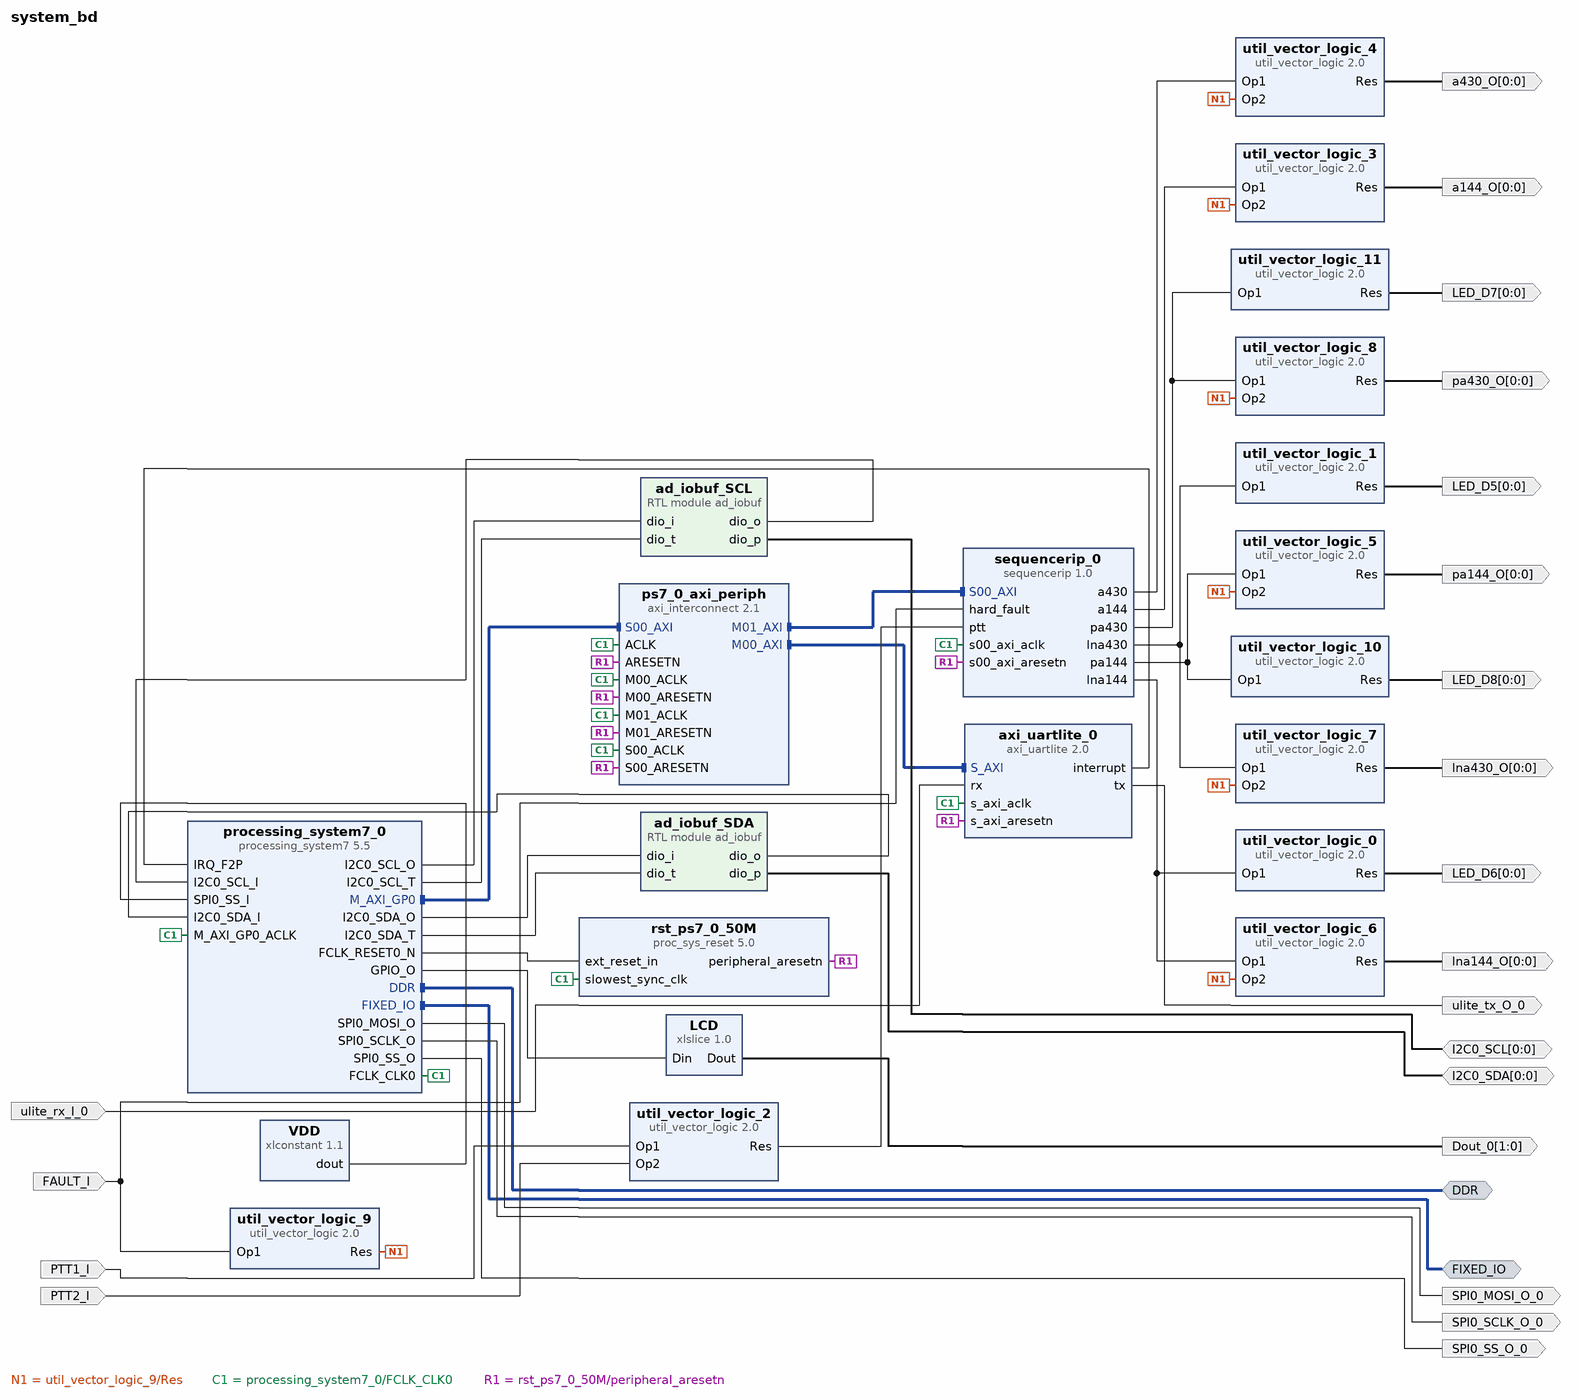
[diagram p0: block diagram of the top level]
# Vivado block design system_bd, xc7z010clg400-1, Vivado 2022.2.2
create_bd_design system_bd

create_bd_intf_port -mode Master -vlnv xilinx.com:interface:ddrx_rtl:1.0 DDR
create_bd_intf_port -mode Master -vlnv xilinx.com:display_processing_system7:fixedio_rtl:1.0 FIXED_IO
create_bd_port -dir O SPI0_SS_O_0
create_bd_port -dir O SPI0_MOSI_O_0
create_bd_port -dir O SPI0_SCLK_O_0
create_bd_port -dir O -from 1 -to 0 Dout_0
create_bd_port -dir I ulite_rx_I_0
create_bd_port -dir O ulite_tx_O_0
create_bd_port -dir O -from 0 -to 0 LED_D5
create_bd_port -dir O -from 0 -to 0 LED_D6
create_bd_port -dir O -from 0 -to 0 LED_D7
create_bd_port -dir O -from 0 -to 0 LED_D8
create_bd_port -dir O -from 0 -to 0 lna144_O
create_bd_port -dir O -from 0 -to 0 pa144_O
create_bd_port -dir O -from 0 -to 0 a144_O
create_bd_port -dir O -from 0 -to 0 lna430_O
create_bd_port -dir O -from 0 -to 0 pa430_O
create_bd_port -dir O -from 0 -to 0 a430_O
create_bd_port -dir I PTT1_I
create_bd_port -dir I PTT2_I
create_bd_port -dir I FAULT_I
create_bd_port -dir IO -from 0 -to 0 I2C0_SDA
create_bd_port -dir IO -from 0 -to 0 I2C0_SCL

create_bd_cell -type ip -vlnv xilinx.com:ip:processing_system7:5.5 processing_system7_0
set_property -dict [list \
  CONFIG.PCW_ENET0_ENET0_IO {MIO 16 .. 27} \
  CONFIG.PCW_ENET0_GRP_MDIO_ENABLE 1 \
  CONFIG.PCW_ENET0_GRP_MDIO_IO {MIO 52 .. 53} \
  CONFIG.PCW_ENET0_PERIPHERAL_ENABLE 1 \
  CONFIG.PCW_ENET0_PERIPHERAL_FREQMHZ {100 Mbps} \
  CONFIG.PCW_ENET_RESET_ENABLE 0 \
  CONFIG.PCW_GPIO_EMIO_GPIO_ENABLE 1 \
  CONFIG.PCW_GPIO_EMIO_GPIO_IO 64 \
  CONFIG.PCW_GPIO_MIO_GPIO_ENABLE 1 \
  CONFIG.PCW_GPIO_MIO_GPIO_IO MIO \
  CONFIG.PCW_I2C0_I2C0_IO EMIO \
  CONFIG.PCW_I2C0_PERIPHERAL_ENABLE 1 \
  CONFIG.PCW_I2C_PERIPHERAL_FREQMHZ 111.111115 \
  CONFIG.PCW_I2C_RESET_ENABLE 0 \
  CONFIG.PCW_IRQ_F2P_INTR 1 \
  CONFIG.PCW_NAND_NAND_IO {MIO 0 2.. 14} \
  CONFIG.PCW_NAND_PERIPHERAL_ENABLE 1 \
  CONFIG.PCW_PRESET_BANK1_VOLTAGE {LVCMOS 2.5V} \
  CONFIG.PCW_SD0_GRP_CD_ENABLE 1 \
  CONFIG.PCW_SD0_GRP_CD_IO {MIO 46} \
  CONFIG.PCW_SD0_GRP_WP_ENABLE 0 \
  CONFIG.PCW_SD0_PERIPHERAL_ENABLE 1 \
  CONFIG.PCW_SD0_SD0_IO {MIO 40 .. 45} \
  CONFIG.PCW_SDIO_PERIPHERAL_FREQMHZ 100 \
  CONFIG.PCW_SPI0_PERIPHERAL_ENABLE 1 \
  CONFIG.PCW_SPI0_SPI0_IO EMIO \
  CONFIG.PCW_UART1_PERIPHERAL_ENABLE 1 \
  CONFIG.PCW_UART1_UART1_IO {MIO 48 .. 49} \
  CONFIG.PCW_UART_PERIPHERAL_FREQMHZ 100 \
  CONFIG.PCW_UIPARAM_DDR_PARTNO {MT41K128M16 JT-125} \
  CONFIG.PCW_USB_RESET_ENABLE 0 \
  CONFIG.PCW_USE_FABRIC_INTERRUPT 1 \
] [get_bd_cells processing_system7_0]
# 220 more settings of processing_system7_0 are not shown: defaults, MIO pin electricals, DDR timing, and values the tool derives
create_bd_cell -type ip -vlnv xilinx.com:ip:xlconstant:1.1 VDD
create_bd_cell -type ip -vlnv xilinx.com:ip:xlslice:1.0 LCD
set_property -dict {CONFIG.DIN_TO 0 CONFIG.DIN_WIDTH 64 CONFIG.DOUT_WIDTH 2} [get_bd_cells LCD]
create_bd_cell -type ip -vlnv xilinx.com:ip:axi_uartlite:2.0 axi_uartlite_0
create_bd_cell -type ip -vlnv xilinx.com:ip:axi_interconnect:2.1 ps7_0_axi_periph
set_property -dict {CONFIG.NUM_MI 2} [get_bd_cells ps7_0_axi_periph]
create_bd_cell -type ip -vlnv xilinx.com:ip:proc_sys_reset:5.0 rst_ps7_0_50M
create_bd_cell -type ip -vlnv xilinx.com:ip:util_vector_logic:2.0 util_vector_logic_0
set_property -dict {CONFIG.C_OPERATION not CONFIG.C_SIZE 1} [get_bd_cells util_vector_logic_0]
create_bd_cell -type ip -vlnv xilinx.com:ip:util_vector_logic:2.0 util_vector_logic_1
set_property -dict {CONFIG.C_OPERATION not CONFIG.C_SIZE 1} [get_bd_cells util_vector_logic_1]
create_bd_cell -type ip -vlnv xilinx.com:ip:util_vector_logic:2.0 util_vector_logic_2
set_property -dict {CONFIG.C_OPERATION and CONFIG.C_SIZE 1} [get_bd_cells util_vector_logic_2]
create_bd_cell -type ip -vlnv xilinx.com:ip:util_vector_logic:2.0 util_vector_logic_3
set_property -dict {CONFIG.C_SIZE 1} [get_bd_cells util_vector_logic_3]
create_bd_cell -type ip -vlnv xilinx.com:ip:util_vector_logic:2.0 util_vector_logic_4
set_property -dict {CONFIG.C_SIZE 1} [get_bd_cells util_vector_logic_4]
create_bd_cell -type ip -vlnv xilinx.com:ip:util_vector_logic:2.0 util_vector_logic_5
set_property -dict {CONFIG.C_SIZE 1} [get_bd_cells util_vector_logic_5]
create_bd_cell -type ip -vlnv xilinx.com:ip:util_vector_logic:2.0 util_vector_logic_6
set_property -dict {CONFIG.C_SIZE 1} [get_bd_cells util_vector_logic_6]
create_bd_cell -type ip -vlnv xilinx.com:ip:util_vector_logic:2.0 util_vector_logic_7
set_property -dict {CONFIG.C_SIZE 1} [get_bd_cells util_vector_logic_7]
create_bd_cell -type ip -vlnv xilinx.com:ip:util_vector_logic:2.0 util_vector_logic_8
set_property -dict {CONFIG.C_SIZE 1} [get_bd_cells util_vector_logic_8]
create_bd_cell -type ip -vlnv xilinx.com:ip:util_vector_logic:2.0 util_vector_logic_9
set_property -dict {CONFIG.C_OPERATION not CONFIG.C_SIZE 1} [get_bd_cells util_vector_logic_9]
create_bd_cell -type ip -vlnv xilinx.com:ip:util_vector_logic:2.0 util_vector_logic_10
set_property -dict {CONFIG.C_OPERATION not CONFIG.C_SIZE 1} [get_bd_cells util_vector_logic_10]
create_bd_cell -type ip -vlnv xilinx.com:ip:util_vector_logic:2.0 util_vector_logic_11
set_property -dict {CONFIG.C_OPERATION not CONFIG.C_SIZE 1} [get_bd_cells util_vector_logic_11]
create_bd_cell -type ip -vlnv xilinx.com:user:sequencerip:1.0 sequencerip_0
create_bd_cell -type module -reference ad_iobuf ad_iobuf_SDA
create_bd_cell -type module -reference ad_iobuf ad_iobuf_SCL

# ---- connections ----

connect_bd_intf_net [get_bd_intf_ports DDR] [get_bd_intf_pins processing_system7_0/DDR]
connect_bd_intf_net [get_bd_intf_ports FIXED_IO] [get_bd_intf_pins processing_system7_0/FIXED_IO]
connect_bd_intf_net [get_bd_intf_pins processing_system7_0/M_AXI_GP0] [get_bd_intf_pins ps7_0_axi_periph/S00_AXI]
connect_bd_intf_net [get_bd_intf_pins ps7_0_axi_periph/M00_AXI] [get_bd_intf_pins axi_uartlite_0/S_AXI]
connect_bd_intf_net [get_bd_intf_pins ps7_0_axi_periph/M01_AXI] [get_bd_intf_pins sequencerip_0/S00_AXI]
connect_bd_net [get_bd_ports FAULT_I] [get_bd_pins util_vector_logic_9/Op1] [get_bd_pins sequencerip_0/hard_fault]
connect_bd_net [get_bd_pins util_vector_logic_9/Res] \
  [get_bd_pins util_vector_logic_7/Op2] [get_bd_pins util_vector_logic_8/Op2] [get_bd_pins util_vector_logic_6/Op2] \
  [get_bd_pins util_vector_logic_5/Op2] [get_bd_pins util_vector_logic_4/Op2] [get_bd_pins util_vector_logic_3/Op2]
connect_bd_net [get_bd_ports I2C0_SDA] [get_bd_pins ad_iobuf_SDA/dio_p]
connect_bd_net [get_bd_ports I2C0_SCL] [get_bd_pins ad_iobuf_SCL/dio_p]
connect_bd_net [get_bd_ports PTT1_I] [get_bd_pins util_vector_logic_2/Op1]
connect_bd_net [get_bd_ports PTT2_I] [get_bd_pins util_vector_logic_2/Op2]
connect_bd_net [get_bd_pins VDD/dout] [get_bd_pins processing_system7_0/SPI0_SS_I]
connect_bd_net -net ad_iobuf_0_dio_o [get_bd_pins ad_iobuf_SDA/dio_o] [get_bd_pins processing_system7_0/I2C0_SDA_I]
connect_bd_net -net ad_iobuf_1_dio_o [get_bd_pins ad_iobuf_SCL/dio_o] [get_bd_pins processing_system7_0/I2C0_SCL_I]
connect_bd_net [get_bd_pins axi_uartlite_0/interrupt] [get_bd_pins processing_system7_0/IRQ_F2P]
connect_bd_net [get_bd_pins axi_uartlite_0/tx] [get_bd_ports ulite_tx_O_0]
connect_bd_net [get_bd_pins processing_system7_0/FCLK_CLK0] \
  [get_bd_pins processing_system7_0/M_AXI_GP0_ACLK] [get_bd_pins ps7_0_axi_periph/S00_ACLK] \
  [get_bd_pins rst_ps7_0_50M/slowest_sync_clk] [get_bd_pins axi_uartlite_0/s_axi_aclk] \
  [get_bd_pins ps7_0_axi_periph/M00_ACLK] [get_bd_pins ps7_0_axi_periph/ACLK] [get_bd_pins ps7_0_axi_periph/M01_ACLK] \
  [get_bd_pins sequencerip_0/s00_axi_aclk]
connect_bd_net [get_bd_pins processing_system7_0/FCLK_RESET0_N] [get_bd_pins rst_ps7_0_50M/ext_reset_in]
connect_bd_net [get_bd_pins processing_system7_0/GPIO_O] [get_bd_pins LCD/Din]
connect_bd_net [get_bd_pins processing_system7_0/I2C0_SCL_O] [get_bd_pins ad_iobuf_SCL/dio_i]
connect_bd_net [get_bd_pins processing_system7_0/I2C0_SCL_T] [get_bd_pins ad_iobuf_SCL/dio_t]
connect_bd_net [get_bd_pins processing_system7_0/I2C0_SDA_O] [get_bd_pins ad_iobuf_SDA/dio_i]
connect_bd_net [get_bd_pins processing_system7_0/I2C0_SDA_T] [get_bd_pins ad_iobuf_SDA/dio_t]
connect_bd_net [get_bd_pins processing_system7_0/SPI0_MOSI_O] [get_bd_ports SPI0_MOSI_O_0]
connect_bd_net [get_bd_pins processing_system7_0/SPI0_SCLK_O] [get_bd_ports SPI0_SCLK_O_0]
connect_bd_net [get_bd_pins processing_system7_0/SPI0_SS_O] [get_bd_ports SPI0_SS_O_0]
connect_bd_net [get_bd_pins rst_ps7_0_50M/peripheral_aresetn] \
  [get_bd_pins ps7_0_axi_periph/S00_ARESETN] [get_bd_pins axi_uartlite_0/s_axi_aresetn] \
  [get_bd_pins ps7_0_axi_periph/M00_ARESETN] [get_bd_pins ps7_0_axi_periph/ARESETN] \
  [get_bd_pins ps7_0_axi_periph/M01_ARESETN] [get_bd_pins sequencerip_0/s00_axi_aresetn]
connect_bd_net -net rx_0_1 [get_bd_ports ulite_rx_I_0] [get_bd_pins axi_uartlite_0/rx]
connect_bd_net [get_bd_pins sequencerip_0/a144] [get_bd_pins util_vector_logic_3/Op1]
connect_bd_net [get_bd_pins sequencerip_0/a430] [get_bd_pins util_vector_logic_4/Op1]
connect_bd_net [get_bd_pins sequencerip_0/lna144] [get_bd_pins util_vector_logic_0/Op1] [get_bd_pins util_vector_logic_6/Op1]
connect_bd_net [get_bd_pins sequencerip_0/lna430] [get_bd_pins util_vector_logic_1/Op1] [get_bd_pins util_vector_logic_7/Op1]
connect_bd_net [get_bd_pins sequencerip_0/pa144] [get_bd_pins util_vector_logic_5/Op1] [get_bd_pins util_vector_logic_10/Op1]
connect_bd_net [get_bd_pins sequencerip_0/pa430] [get_bd_pins util_vector_logic_8/Op1] [get_bd_pins util_vector_logic_11/Op1]
connect_bd_net [get_bd_pins util_vector_logic_0/Res] [get_bd_ports LED_D6]
connect_bd_net [get_bd_pins util_vector_logic_10/Res] [get_bd_ports LED_D8]
connect_bd_net [get_bd_pins util_vector_logic_11/Res] [get_bd_ports LED_D7]
connect_bd_net [get_bd_pins util_vector_logic_1/Res] [get_bd_ports LED_D5]
connect_bd_net [get_bd_pins util_vector_logic_2/Res] [get_bd_pins sequencerip_0/ptt]
connect_bd_net [get_bd_pins util_vector_logic_3/Res] [get_bd_ports a144_O]
connect_bd_net [get_bd_pins util_vector_logic_4/Res] [get_bd_ports a430_O]
connect_bd_net [get_bd_pins util_vector_logic_5/Res] [get_bd_ports pa144_O]
connect_bd_net [get_bd_pins util_vector_logic_6/Res] [get_bd_ports lna144_O]
connect_bd_net [get_bd_pins util_vector_logic_7/Res] [get_bd_ports lna430_O]
connect_bd_net [get_bd_pins util_vector_logic_8/Res] [get_bd_ports pa430_O]
connect_bd_net -net xlslice_0_Dout [get_bd_pins LCD/Dout] [get_bd_ports Dout_0]

# ---- address map ----
assign_bd_address -offset 0x42C00000 -range 64K -target_address_space [get_bd_addr_spaces processing_system7_0/Data] [get_bd_addr_segs axi_uartlite_0/S_AXI/Reg]
assign_bd_address -offset 0x43C00000 -range 64K -target_address_space [get_bd_addr_spaces processing_system7_0/Data] [get_bd_addr_segs sequencerip_0/S00_AXI/S00_AXI_reg]

validate_bd_design
save_bd_design
